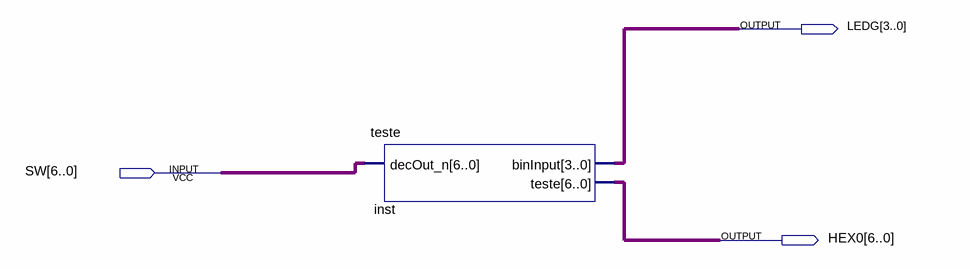
[diagram p0: schematic sheet]
// Quartus schematic bla.bdf as structural Verilog: 1 symbols, 3 pins
module bla (
  input  [6:0] SW,
  output [3:0] LEDG,
  output [6:0] HEX0
);

  teste inst (.decOut_n(SW), .binInput(LEDG), .teste(HEX0));
endmodule
